# EAGLE schematic rev1 (EAGLE 7.2.0)
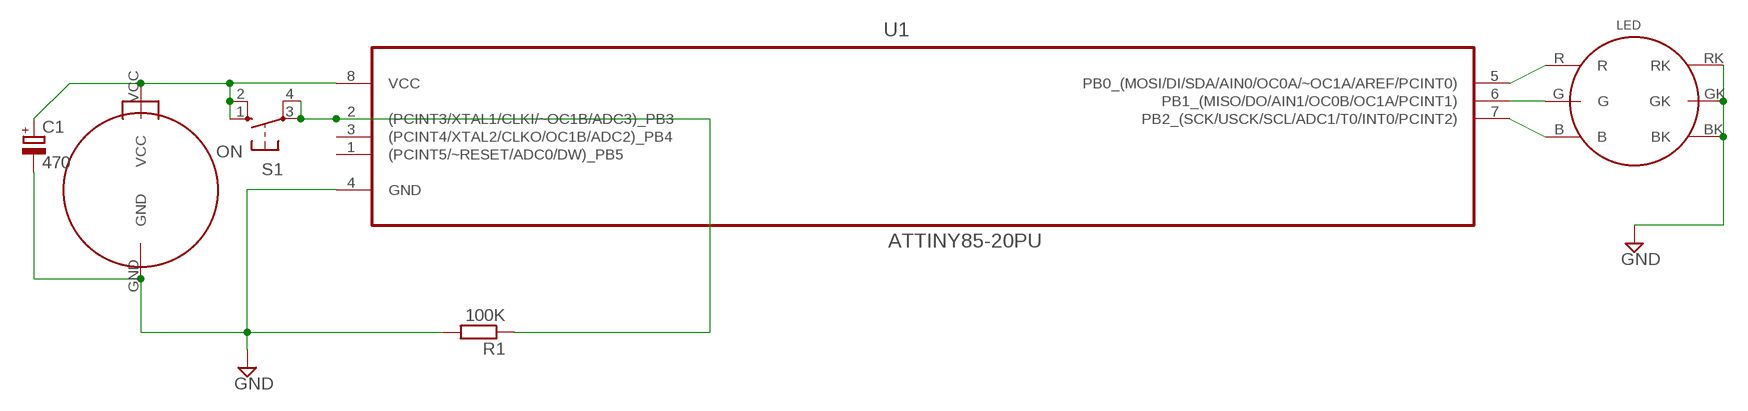
[diagram p0: schematic, sheet 1]

## Parts
C1  470  CPOL-EUE5-8.5  [E5-8,5]
LED  3WLED  [3WRGB]
R1  100K  R-EU_0207/15  [0207/15]
S1  ON  10-XX  [B3F-10XX]
U1  ATTINY85-20PU  [DIP254P762X533-8]
U$1  CR2032_2PIN  [CR2032_2PIN]

## Nets
BLUE: LED.B U1.7(PB2_(SCK/USCK/SCL/ADC1/T0/INT0/PCINT2))
GND: C1.- LED.BK LED.GK LED.RK R1.2 U1.4(GND) U$1.GND
GREEN: LED.G U1.6(PB1_(MISO/DO/AIN1/OC0B/OC1A/PCINT1))
N$4: R1.1 S1.3(P) S1.4(P1) U1.2((PCINT3/XTAL1/CLKI/~OC1B/ADC3)_PB3)
RED: LED.R U1.5(PB0_(MOSI/DI/SDA/AIN0/OC0A/~OC1A/AREF/PCINT0))
VCC: C1.+ S1.1(S) S1.2(S1) U1.8(VCC) U$1.VCC
Unconnected: U1.1((PCINT5/~RESET/ADC0/DW)_PB5) U1.3((PCINT4/XTAL2/CLKO/OC1B/ADC2)_PB4)

## Library data of the parts
C1 = rcl:CPOL-EU: POLARIZED CAPACITOR, European symbol
LED = Ledpart:3WLED
R1 = rcl:R-EU_: RESISTOR, European symbol
S1 = switch-omron:10-XX: OMRON SWITCH; MPN: B3F-1000; OC_FARNELL: 176432; OC_NEWARK: 36M3542
U1 = Atmel_By_element14_Batch_1-00:ATTINY85-20PU: 8-bit Microcontroller with In-System Programmable Flash; MPN: ATTINY85-20PU; OC_FARNELL: 1455162; OC_NEWARK: 58M3796; PACKAGE: PDIP-8; SUPPLIER: Atmel
U$1 = Ledpart:CR2032_2PIN